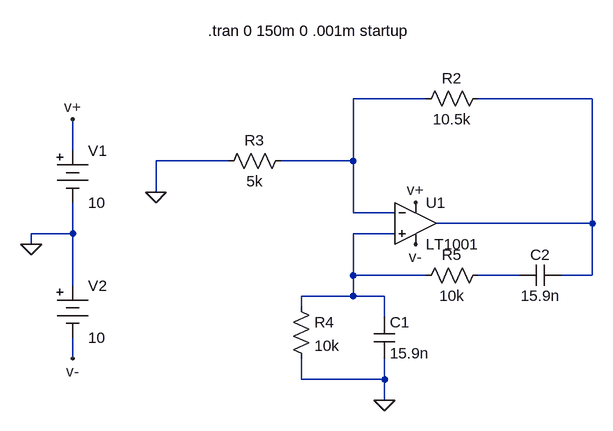
[diagram p0: schematic wien1.asc]
wien1.asc, the LTspice schematic file:
Version 4
SHEET 1 880 680
WIRE 160 -48 48 -48
WIRE 416 -48 240 -48
WIRE -384 32 -384 -16
WIRE -144 48 -256 48
WIRE 48 48 48 -48
WIRE 48 48 -64 48
WIRE -256 96 -256 48
WIRE 48 128 48 48
WIRE 112 128 48 128
WIRE 416 144 416 -48
WIRE 416 144 176 144
WIRE -384 160 -384 112
WIRE -384 160 -448 160
WIRE 112 160 48 160
WIRE -448 176 -448 160
WIRE 48 224 48 160
WIRE 160 224 48 224
WIRE 304 224 240 224
WIRE 416 224 416 144
WIRE 416 224 368 224
WIRE -384 240 -384 160
WIRE 48 256 48 224
WIRE 48 256 -32 256
WIRE 96 256 48 256
WIRE -32 272 -32 256
WIRE 96 288 96 256
WIRE -384 352 -384 320
WIRE -32 384 -32 352
WIRE 96 384 96 352
WIRE 96 384 -32 384
WIRE 96 416 96 384
FLAG -256 96 0
FLAG 96 416 0
FLAG -448 176 0
FLAG -384 -16 v+
FLAG -384 352 v-
FLAG 144 176 v-
FLAG 144 112 v+
SYMBOL Opamps\\LT1001 144 80 R0
SYMATTR InstName U1
SYMBOL res 256 -64 R90
WINDOW 0 0 56 VBottom 2
WINDOW 3 32 56 VTop 2
SYMATTR InstName R2
SYMATTR Value 10.5k
SYMBOL res -48 32 R90
WINDOW 0 0 56 VBottom 2
WINDOW 3 32 56 VTop 2
SYMATTR InstName R3
SYMATTR Value 5k
SYMBOL cap 80 288 R0
SYMATTR InstName C1
SYMATTR Value 15.9n
SYMBOL res 256 208 R90
WINDOW 0 0 56 VBottom 2
WINDOW 3 32 56 VTop 2
SYMATTR InstName R5
SYMATTR Value 10k
SYMBOL cap 368 208 R90
WINDOW 0 0 32 VBottom 2
WINDOW 3 32 32 VTop 2
SYMATTR InstName C2
SYMATTR Value 15.9n
SYMBOL res -48 256 R0
SYMATTR InstName R4
SYMATTR Value 10k
SYMBOL Misc\\battery -384 16 R0
WINDOW 123 0 0 Left 2
WINDOW 39 0 0 Left 2
SYMATTR InstName V1
SYMATTR Value 10
SYMBOL Misc\\battery -384 224 R0
WINDOW 123 0 0 Left 2
WINDOW 39 0 0 Left 2
SYMATTR InstName V2
SYMATTR Value 10
TEXT -176 -152 Left 2 !.tran 0 150m 0 .001m startup

The netlist it stands for:
* wien1.asc
XU1 N003 N001 v+ v- N002 LT1001  ; pins In+ In- V+ V- OUT
R2 N002 N001 10.5k
R3 N001 0 5k
C1 N003 0 15.9n
R5 N004 N003 10k
C2 N002 N004 15.9n
R4 N003 0 10k
V1 v+ 0 10
V2 0 v- 10
.tran 0 150m 0 .001m startup
.lib LTC.lib
.backanno
.end